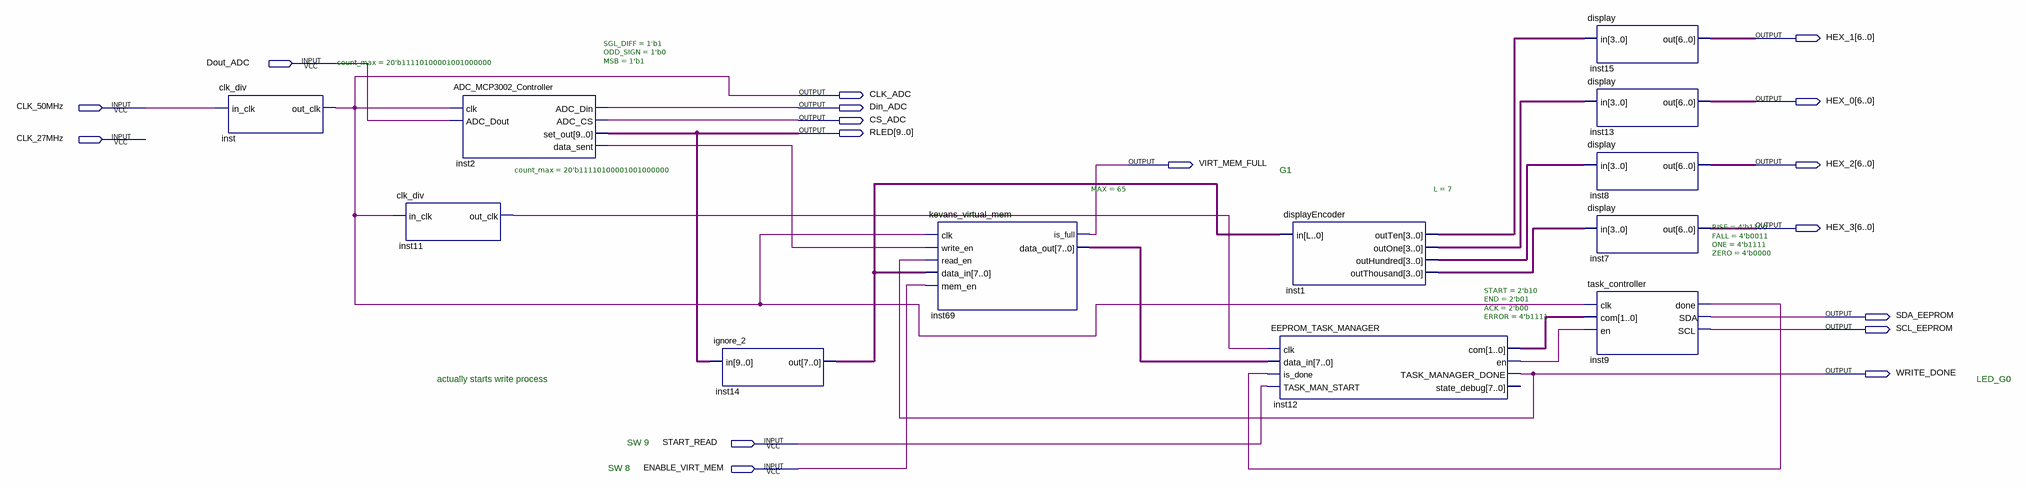
[diagram p0: schematic sheet]
// Quartus schematic Project_1.bdf as structural Verilog: 12 symbols, 17 pins
module Project_1 (
  input  Dout_ADC,
  input  CLK_50MHz,
  input  CLK_27MHz,
  input  START_READ,
  input  ENABLE_VIRT_MEM,
  output [6:0] HEX_1,
  output CLK_ADC,
  output [6:0] HEX_0,
  output Din_ADC,
  output CS_ADC,
  output [9:0] RLED,
  output VIRT_MEM_FULL,
  output [6:0] HEX_2,
  output [6:0] HEX_3,
  output SDA_EEPROM,
  output SCL_EEPROM,
  output WRITE_DONE
);

  wire inst2_data_sent, inst9_done, inst11_out_clk, inst12_en;
  wire [1:0] inst12_com;
  wire [3:0] inst1_outhundred, inst1_outone, inst1_outten, inst1_outthousand;
  wire [7:0] inst14_out, inst69_data_out;

  clk_div #(.count_max(20'b11110100001001000000)) inst (.in_clk(CLK_50MHz), .out_clk(CLK_ADC));
  clk_div #(.count_max(20'b11110100001001000000)) inst11 (.in_clk(CLK_ADC), .out_clk(inst11_out_clk));
  ADC_MCP3002_Controller #(.SGL_DIFF(1'b1), .ODD_SIGN(1'b0), .MSB(1'b1)) inst2 (
    .clk(CLK_ADC), .ADC_Dout(Dout_ADC), .ADC_Din(Din_ADC), .ADC_CS(CS_ADC), .set_out(RLED),
    .data_sent(inst2_data_sent));
  ignore_2 inst14 (.in(RLED), .out(inst14_out));
  kevans_virtual_mem #(.MAX(65)) inst69 (
    .clk(CLK_ADC), .write_en(inst2_data_sent), .read_en(WRITE_DONE), .data_in(inst14_out),
    .mem_en(ENABLE_VIRT_MEM), .is_full(VIRT_MEM_FULL), .data_out(inst69_data_out));
  EEPROM_TASK_MANAGER #(.START(2'b10), .END(2'b01), .ACK(2'b00), .ERROR(4'b1111)) inst12 (
    .clk(inst11_out_clk), .data_in(inst69_data_out), .is_done(inst9_done), .TASK_MAN_START(START_READ),
    .com(inst12_com), .en(inst12_en), .TASK_MANAGER_DONE(WRITE_DONE));  // open: state_debug
  displayEncoder #(.L(7)) inst1 (
    .in(inst14_out), .outTen(inst1_outten), .outOne(inst1_outone), .outHundred(inst1_outhundred),
    .outThousand(inst1_outthousand));
  display inst15 (.in(inst1_outten), .out(HEX_1));
  display inst13 (.in(inst1_outone), .out(HEX_0));
  display inst8 (.in(inst1_outhundred), .out(HEX_2));
  display inst7 (.in(inst1_outthousand), .out(HEX_3));
  task_controller #(.RISE(4'b1100), .FALL(4'b0011), .ONE(4'b1111), .ZERO(4'b0000)) inst9 (
    .clk(CLK_ADC), .com(inst12_com), .en(inst12_en), .done(inst9_done), .SDA(SDA_EEPROM), .SCL(SCL_EEPROM));

  // Notes on the sheet:
  //   G1
  //   actually starts write process
  //   LED_G0
  //   SW 9
  //   SW 8
endmodule
